# EAGLE schematic 5V POWER SUPPLY (EAGLE 9.6.2)
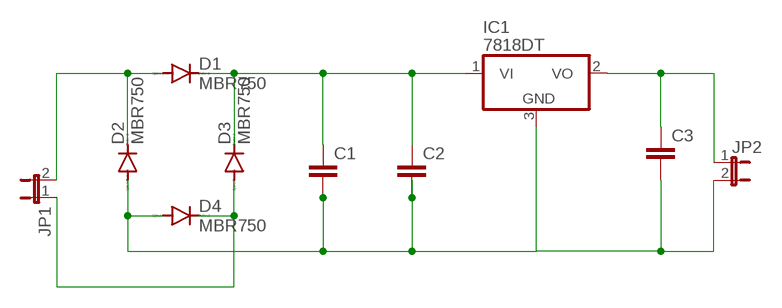
[diagram p0: schematic, sheet 1]

## Parts
C1  C22/6  [C22.5B6]
C2  C22/6  [C22.5B6]
C3  C22/6  [C22.5B6]
D1  MBR750  [TO220AC]
D2  MBR750  [TO220AC]
D3  MBR750  [TO220AC]
D4  MBR750  [TO220AC]
IC1  7818DT  [TO252]
JP1  JP1E  [JP1]
JP2  JP1E  [JP1]

## Nets
N$1: C1.2 C2.2 C3.2 D2.A D4.A IC1.3(GND) JP2.2
N$2: D3.A D4.C JP1.1
N$3: D1.A D2.C JP1.2
N$4: C1.1 C2.1 D1.C D3.C IC1.1(VI)
N$5: C3.1 IC1.2(VO) JP2.1

## Library data of the parts
C1-C3 = capacitor-wima:C: CAPACITOR naming: grid - package width
D1-D4 = diode:MBR750: DIODE barrier rectifier, 7.5 A, 50 V
IC1 = linear:78*: Positive VOLTAGE REGULATOR Source: http://cache.national.com/ds/LM/LM78L05.pdf http://www.fairchildsemi.com/ds/LM/LM7805.pdf
JP1 JP2 = jumper:JP1E: JUMPER